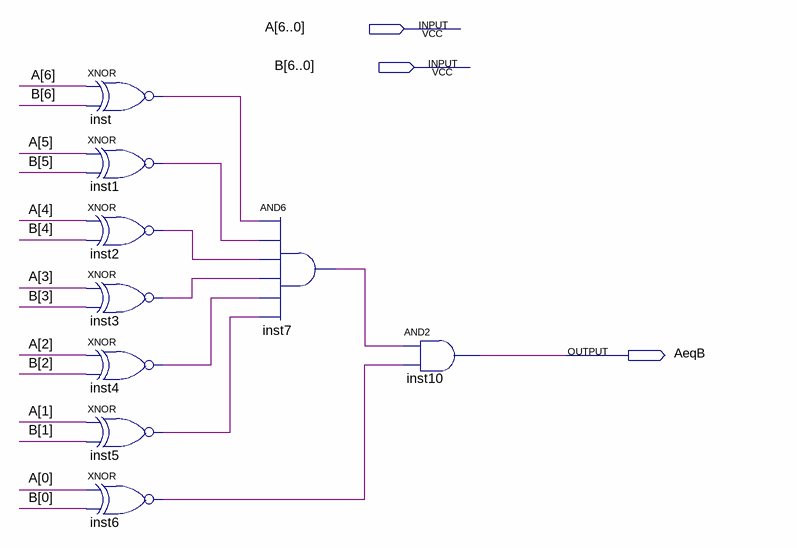
[diagram p0: schematic sheet]
// Quartus schematic g09_comp7.bdf as structural Verilog: 9 symbols, 3 pins
module g09_comp7 (
  input  [6:0] A,
  input  [6:0] B,
  output AeqB
);

  wire inst1_out, inst2_out, inst3_out, inst4_out, inst5_out, inst6_out, inst7_out, inst_out;

  xnor inst (inst_out, A[6], B[6]);
  xnor inst1 (inst1_out, A[5], B[5]);
  xnor inst2 (inst2_out, A[4], B[4]);
  xnor inst3 (inst3_out, A[3], B[3]);
  xnor inst4 (inst4_out, A[2], B[2]);
  xnor inst5 (inst5_out, A[1], B[1]);
  xnor inst6 (inst6_out, A[0], B[0]);
  and inst7 (inst7_out, inst_out, inst1_out, inst2_out, inst3_out, inst4_out, inst5_out);
  and inst10 (AeqB, inst7_out, inst6_out);
endmodule
